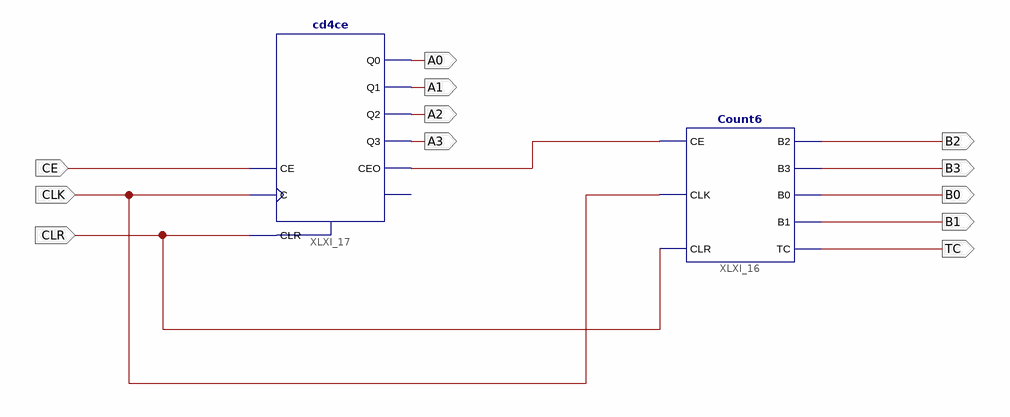
[diagram p0: schematic sheet 1]
// Xilinx ISE schematic Second.sch (spartan6) as structural Verilog: 2 symbols, 12 ports
module Second (
  input  CLR,
  input  CE,
  input  CLK,
  output A0,
  output A1,
  output A2,
  output A3,
  output B3,
  output B0,
  output B2,
  output TC,
  output B1
);

  wire XLXN_25;

  Count6 XLXI_16 (.CE(XLXN_25), .CLK(CLK), .CLR(CLR), .B2(B2), .B3(B3), .B0(B0), .B1(B1), .TC(TC));
  cd4ce XLXI_17 (.C(CLK), .CE(CE), .CLR(CLR), .CEO(XLXN_25), .Q0(A0), .Q1(A1), .Q2(A2), .Q3(A3));  // open: TC
endmodule
